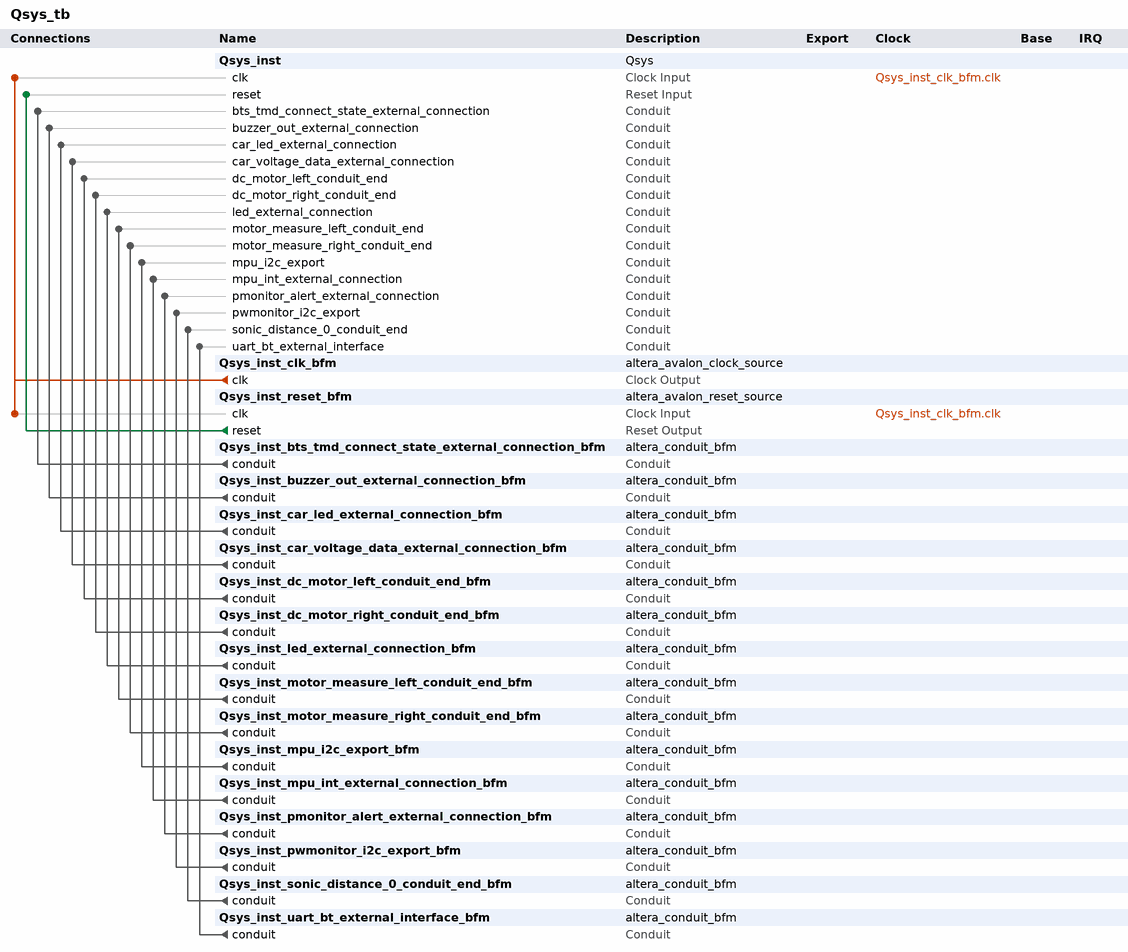
[diagram p0: system contents]
# Platform Designer (Qsys) system Qsys_tb, Cyclone V 5CSEBA6U23I7
# Parameters at their usual value, and those the tool derives, are not listed.
package require -exact qsys 16.0
create_system Qsys_tb
set_project_property DEVICE_FAMILY {Cyclone V}
set_project_property DEVICE 5CSEBA6U23I7

add_instance Qsys_inst Qsys 1.0

add_instance Qsys_inst_clk_bfm altera_avalon_clock_source 16.0

add_instance Qsys_inst_reset_bfm altera_avalon_reset_source 16.0
set_instance_parameter_value Qsys_inst_reset_bfm ASSERT_HIGH_RESET 0
set_instance_parameter_value Qsys_inst_reset_bfm INITIAL_RESET_CYCLES 50

add_instance Qsys_inst_bts_tmd_connect_state_external_connection_bfm altera_conduit_bfm 16.0
set_instance_parameter_value Qsys_inst_bts_tmd_connect_state_external_connection_bfm CLOCKED_SIGNAL false
set_instance_parameter_value Qsys_inst_bts_tmd_connect_state_external_connection_bfm ENABLE_RESET false
set_instance_parameter_value Qsys_inst_bts_tmd_connect_state_external_connection_bfm SIGNAL_DIRECTIONS output
set_instance_parameter_value Qsys_inst_bts_tmd_connect_state_external_connection_bfm SIGNAL_WIDTHS 1

add_instance Qsys_inst_buzzer_out_external_connection_bfm altera_conduit_bfm 16.0
set_instance_parameter_value Qsys_inst_buzzer_out_external_connection_bfm CLOCKED_SIGNAL false
set_instance_parameter_value Qsys_inst_buzzer_out_external_connection_bfm ENABLE_RESET false
set_instance_parameter_value Qsys_inst_buzzer_out_external_connection_bfm SIGNAL_DIRECTIONS input
set_instance_parameter_value Qsys_inst_buzzer_out_external_connection_bfm SIGNAL_WIDTHS 1

add_instance Qsys_inst_car_led_external_connection_bfm altera_conduit_bfm 16.0
set_instance_parameter_value Qsys_inst_car_led_external_connection_bfm CLOCKED_SIGNAL false
set_instance_parameter_value Qsys_inst_car_led_external_connection_bfm ENABLE_RESET false
set_instance_parameter_value Qsys_inst_car_led_external_connection_bfm SIGNAL_DIRECTIONS input
set_instance_parameter_value Qsys_inst_car_led_external_connection_bfm SIGNAL_WIDTHS 2

add_instance Qsys_inst_car_voltage_data_external_connection_bfm altera_conduit_bfm 16.0
set_instance_parameter_value Qsys_inst_car_voltage_data_external_connection_bfm CLOCKED_SIGNAL false
set_instance_parameter_value Qsys_inst_car_voltage_data_external_connection_bfm ENABLE_RESET false
set_instance_parameter_value Qsys_inst_car_voltage_data_external_connection_bfm SIGNAL_DIRECTIONS output
set_instance_parameter_value Qsys_inst_car_voltage_data_external_connection_bfm SIGNAL_WIDTHS 12

add_instance Qsys_inst_dc_motor_left_conduit_end_bfm altera_conduit_bfm 16.0
set_instance_parameter_value Qsys_inst_dc_motor_left_conduit_end_bfm CLOCKED_SIGNAL false
set_instance_parameter_value Qsys_inst_dc_motor_left_conduit_end_bfm ENABLE_RESET false
set_instance_parameter_value Qsys_inst_dc_motor_left_conduit_end_bfm SIGNAL_DIRECTIONS input,input
set_instance_parameter_value Qsys_inst_dc_motor_left_conduit_end_bfm SIGNAL_ROLES motor_p,motor_n
set_instance_parameter_value Qsys_inst_dc_motor_left_conduit_end_bfm SIGNAL_WIDTHS 1,1

add_instance Qsys_inst_dc_motor_right_conduit_end_bfm altera_conduit_bfm 16.0
set_instance_parameter_value Qsys_inst_dc_motor_right_conduit_end_bfm CLOCKED_SIGNAL false
set_instance_parameter_value Qsys_inst_dc_motor_right_conduit_end_bfm ENABLE_RESET false
set_instance_parameter_value Qsys_inst_dc_motor_right_conduit_end_bfm SIGNAL_DIRECTIONS input,input
set_instance_parameter_value Qsys_inst_dc_motor_right_conduit_end_bfm SIGNAL_ROLES motor_p,motor_n
set_instance_parameter_value Qsys_inst_dc_motor_right_conduit_end_bfm SIGNAL_WIDTHS 1,1

add_instance Qsys_inst_led_external_connection_bfm altera_conduit_bfm 16.0
set_instance_parameter_value Qsys_inst_led_external_connection_bfm CLOCKED_SIGNAL false
set_instance_parameter_value Qsys_inst_led_external_connection_bfm ENABLE_RESET false
set_instance_parameter_value Qsys_inst_led_external_connection_bfm SIGNAL_DIRECTIONS input
set_instance_parameter_value Qsys_inst_led_external_connection_bfm SIGNAL_WIDTHS 8

add_instance Qsys_inst_motor_measure_left_conduit_end_bfm altera_conduit_bfm 16.0
set_instance_parameter_value Qsys_inst_motor_measure_left_conduit_end_bfm CLOCKED_SIGNAL false
set_instance_parameter_value Qsys_inst_motor_measure_left_conduit_end_bfm ENABLE_RESET false
set_instance_parameter_value Qsys_inst_motor_measure_left_conduit_end_bfm SIGNAL_DIRECTIONS output
set_instance_parameter_value Qsys_inst_motor_measure_left_conduit_end_bfm SIGNAL_ROLES ab
set_instance_parameter_value Qsys_inst_motor_measure_left_conduit_end_bfm SIGNAL_WIDTHS 2

add_instance Qsys_inst_motor_measure_right_conduit_end_bfm altera_conduit_bfm 16.0
set_instance_parameter_value Qsys_inst_motor_measure_right_conduit_end_bfm CLOCKED_SIGNAL false
set_instance_parameter_value Qsys_inst_motor_measure_right_conduit_end_bfm ENABLE_RESET false
set_instance_parameter_value Qsys_inst_motor_measure_right_conduit_end_bfm SIGNAL_DIRECTIONS output
set_instance_parameter_value Qsys_inst_motor_measure_right_conduit_end_bfm SIGNAL_ROLES ab
set_instance_parameter_value Qsys_inst_motor_measure_right_conduit_end_bfm SIGNAL_WIDTHS 2

add_instance Qsys_inst_mpu_i2c_export_bfm altera_conduit_bfm 16.0
set_instance_parameter_value Qsys_inst_mpu_i2c_export_bfm CLOCKED_SIGNAL false
set_instance_parameter_value Qsys_inst_mpu_i2c_export_bfm ENABLE_RESET false
set_instance_parameter_value Qsys_inst_mpu_i2c_export_bfm SIGNAL_DIRECTIONS bidir,bidir
set_instance_parameter_value Qsys_inst_mpu_i2c_export_bfm SIGNAL_ROLES scl_pad_io,sda_pad_io
set_instance_parameter_value Qsys_inst_mpu_i2c_export_bfm SIGNAL_WIDTHS 1,1

add_instance Qsys_inst_mpu_int_external_connection_bfm altera_conduit_bfm 16.0
set_instance_parameter_value Qsys_inst_mpu_int_external_connection_bfm CLOCKED_SIGNAL false
set_instance_parameter_value Qsys_inst_mpu_int_external_connection_bfm ENABLE_RESET false
set_instance_parameter_value Qsys_inst_mpu_int_external_connection_bfm SIGNAL_DIRECTIONS output
set_instance_parameter_value Qsys_inst_mpu_int_external_connection_bfm SIGNAL_WIDTHS 1

add_instance Qsys_inst_pmonitor_alert_external_connection_bfm altera_conduit_bfm 16.0
set_instance_parameter_value Qsys_inst_pmonitor_alert_external_connection_bfm CLOCKED_SIGNAL false
set_instance_parameter_value Qsys_inst_pmonitor_alert_external_connection_bfm ENABLE_RESET false
set_instance_parameter_value Qsys_inst_pmonitor_alert_external_connection_bfm SIGNAL_DIRECTIONS output
set_instance_parameter_value Qsys_inst_pmonitor_alert_external_connection_bfm SIGNAL_WIDTHS 1

add_instance Qsys_inst_pwmonitor_i2c_export_bfm altera_conduit_bfm 16.0
set_instance_parameter_value Qsys_inst_pwmonitor_i2c_export_bfm CLOCKED_SIGNAL false
set_instance_parameter_value Qsys_inst_pwmonitor_i2c_export_bfm ENABLE_RESET false
set_instance_parameter_value Qsys_inst_pwmonitor_i2c_export_bfm SIGNAL_DIRECTIONS bidir,bidir
set_instance_parameter_value Qsys_inst_pwmonitor_i2c_export_bfm SIGNAL_ROLES scl_pad_io,sda_pad_io
set_instance_parameter_value Qsys_inst_pwmonitor_i2c_export_bfm SIGNAL_WIDTHS 1,1

add_instance Qsys_inst_sonic_distance_0_conduit_end_bfm altera_conduit_bfm 16.0
set_instance_parameter_value Qsys_inst_sonic_distance_0_conduit_end_bfm CLOCKED_SIGNAL false
set_instance_parameter_value Qsys_inst_sonic_distance_0_conduit_end_bfm ENABLE_RESET false
set_instance_parameter_value Qsys_inst_sonic_distance_0_conduit_end_bfm SIGNAL_DIRECTIONS output,input
set_instance_parameter_value Qsys_inst_sonic_distance_0_conduit_end_bfm SIGNAL_ROLES echo,trigger
set_instance_parameter_value Qsys_inst_sonic_distance_0_conduit_end_bfm SIGNAL_WIDTHS 1,1

add_instance Qsys_inst_uart_bt_external_interface_bfm altera_conduit_bfm 16.0
set_instance_parameter_value Qsys_inst_uart_bt_external_interface_bfm CLOCKED_SIGNAL false
set_instance_parameter_value Qsys_inst_uart_bt_external_interface_bfm ENABLE_RESET false
set_instance_parameter_value Qsys_inst_uart_bt_external_interface_bfm SIGNAL_DIRECTIONS output,input
set_instance_parameter_value Qsys_inst_uart_bt_external_interface_bfm SIGNAL_ROLES RXD,TXD
set_instance_parameter_value Qsys_inst_uart_bt_external_interface_bfm SIGNAL_WIDTHS 1,1

# connections
add_connection Qsys_inst_clk_bfm.clk Qsys_inst.clk clock
add_connection Qsys_inst_clk_bfm.clk Qsys_inst_reset_bfm.clk clock
add_connection Qsys_inst_reset_bfm.reset Qsys_inst.reset reset
add_connection Qsys_inst_bts_tmd_connect_state_external_connection_bfm.conduit Qsys_inst.bts_tmd_connect_state_external_connection conduit
add_connection Qsys_inst_buzzer_out_external_connection_bfm.conduit Qsys_inst.buzzer_out_external_connection conduit
add_connection Qsys_inst_car_led_external_connection_bfm.conduit Qsys_inst.car_led_external_connection conduit
add_connection Qsys_inst_car_voltage_data_external_connection_bfm.conduit Qsys_inst.car_voltage_data_external_connection conduit
add_connection Qsys_inst_dc_motor_left_conduit_end_bfm.conduit Qsys_inst.dc_motor_left_conduit_end conduit
add_connection Qsys_inst_dc_motor_right_conduit_end_bfm.conduit Qsys_inst.dc_motor_right_conduit_end conduit
add_connection Qsys_inst_led_external_connection_bfm.conduit Qsys_inst.led_external_connection conduit
add_connection Qsys_inst_motor_measure_left_conduit_end_bfm.conduit Qsys_inst.motor_measure_left_conduit_end conduit
add_connection Qsys_inst_motor_measure_right_conduit_end_bfm.conduit Qsys_inst.motor_measure_right_conduit_end conduit
add_connection Qsys_inst_mpu_i2c_export_bfm.conduit Qsys_inst.mpu_i2c_export conduit
add_connection Qsys_inst_mpu_int_external_connection_bfm.conduit Qsys_inst.mpu_int_external_connection conduit
add_connection Qsys_inst_pmonitor_alert_external_connection_bfm.conduit Qsys_inst.pmonitor_alert_external_connection conduit
add_connection Qsys_inst_pwmonitor_i2c_export_bfm.conduit Qsys_inst.pwmonitor_i2c_export conduit
add_connection Qsys_inst_sonic_distance_0_conduit_end_bfm.conduit Qsys_inst.sonic_distance_0_conduit_end conduit
add_connection Qsys_inst_uart_bt_external_interface_bfm.conduit Qsys_inst.uart_bt_external_interface conduit

set_interconnect_requirement {$system} qsys_mm.clockCrossingAdapter HANDSHAKE
set_interconnect_requirement {$system} qsys_mm.enableEccProtection FALSE
set_interconnect_requirement {$system} qsys_mm.insertDefaultSlave FALSE
set_interconnect_requirement {$system} qsys_mm.maxAdditionalLatency 1

save_system Qsys_tb.qsys
